# EAGLE design IOIO (EAGLE 5.11)
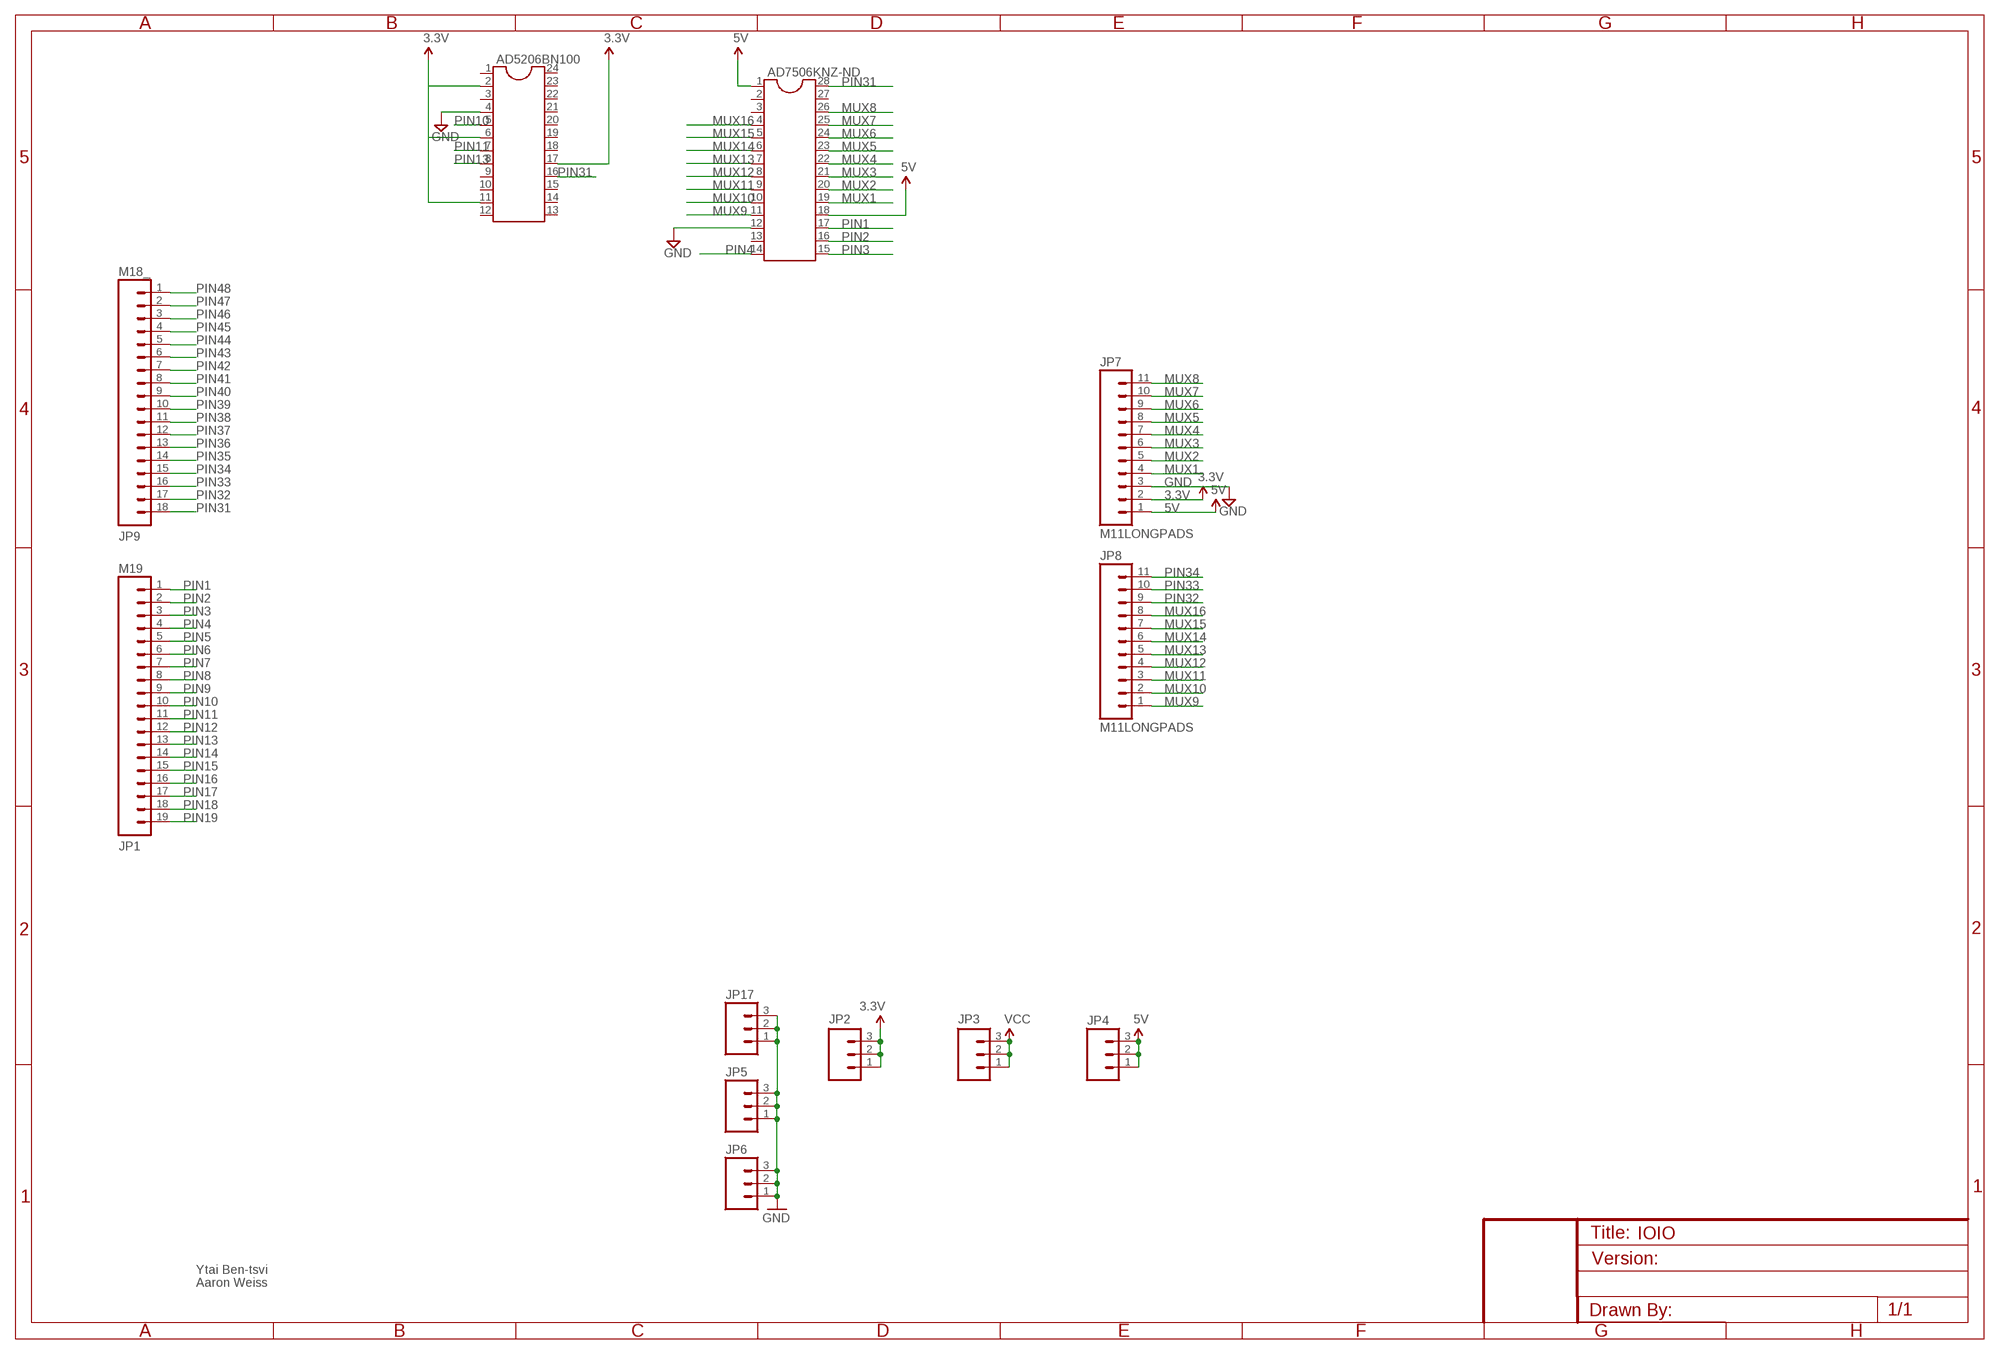
[diagram p0: schematic, sheet 1]

## Parts
AD5206BN100  DIL24-3  [DIL24-3]
AD7506KNZ-ND  DIL28  [DIL28-6]
JP1  M19  [1X19]
JP2  M03PTH  [1X03]
JP3  M03PTH  [1X03]
JP4  M03PTH  [1X03]
JP5  M03PTH  [1X03]
JP6  M03PTH  [1X03]
JP7  M11LONGPADS  [1X11_LONGPADS]
JP8  M11LONGPADS  [1X11_LONGPADS]
JP9  M18_  [1X18]
JP17  M03PTH  [1X03]

## Nets
3.3V: AD5206BN100.2 AD5206BN100.6 AD5206BN100.11 AD5206BN100.17 JP2.1 JP2.2 JP2.3 JP7.2
5V: AD7506KNZ-ND.1 AD7506KNZ-ND.18 JP4.1 JP4.2 JP4.3 JP7.1
GND: AD5206BN100.4 AD7506KNZ-ND.12 JP5.1 JP5.2 JP5.3 JP6.1 JP6.2 JP6.3 JP7.3 JP17.1 JP17.2 JP17.3
MUX1: AD7506KNZ-ND.19 JP7.4
MUX2: AD7506KNZ-ND.20 JP7.5
MUX3: AD7506KNZ-ND.21 JP7.6
MUX4: AD7506KNZ-ND.22 JP7.7
MUX5: AD7506KNZ-ND.23 JP7.8
MUX6: AD7506KNZ-ND.24 JP7.9
MUX7: AD7506KNZ-ND.25 JP7.10
MUX8: AD7506KNZ-ND.26 JP7.11
MUX9: AD7506KNZ-ND.11 JP8.1
MUX10: AD7506KNZ-ND.10 JP8.2
MUX11: AD7506KNZ-ND.9 JP8.3
MUX12: AD7506KNZ-ND.8 JP8.4
MUX13: AD7506KNZ-ND.7 JP8.5
MUX14: AD7506KNZ-ND.6 JP8.6
MUX15: AD7506KNZ-ND.5 JP8.7
MUX16: AD7506KNZ-ND.4 JP8.8
PIN1: AD7506KNZ-ND.17 JP1.1
PIN2: AD7506KNZ-ND.16 JP1.2
PIN3: AD7506KNZ-ND.15 JP1.3
PIN4: AD7506KNZ-ND.14 JP1.4
PIN5: JP1.5
PIN6: JP1.6
PIN7: JP1.7
PIN8: JP1.8
PIN9: JP1.9
PIN10: AD5206BN100.5 JP1.10
PIN11: AD5206BN100.7 JP1.11
PIN12: JP1.12
PIN13: AD5206BN100.8 JP1.13
PIN14: JP1.14
PIN15: JP1.15
PIN16: JP1.16
PIN17: JP1.17
PIN18: JP1.18
PIN19: JP1.19
PIN31: AD5206BN100.16 AD7506KNZ-ND.28 JP9.18
PIN32: JP8.9 JP9.17
PIN33: JP8.10 JP9.16
PIN34: JP8.11 JP9.15
PIN35: JP9.14
PIN36: JP9.13
PIN37: JP9.12
PIN38: JP9.11
PIN39: JP9.10
PIN40: JP9.9
PIN41: JP9.8
PIN42: JP9.7
PIN43: JP9.6
PIN44: JP9.5
PIN45: JP9.4
PIN46: JP9.3
PIN47: JP9.2
PIN48: JP9.1
VCC: JP3.1 JP3.2 JP3.3
Unconnected: AD5206BN100.1 AD5206BN100.3 AD5206BN100.9 AD5206BN100.10 AD5206BN100.12 AD5206BN100.13 AD5206BN100.14 AD5206BN100.15 AD5206BN100.18 AD5206BN100.19 AD5206BN100.20 AD5206BN100.21 AD5206BN100.22 AD5206BN100.23 AD5206BN100.24 AD7506KNZ-ND.2 AD7506KNZ-ND.3 AD7506KNZ-ND.13 AD7506KNZ-ND.27

## Notes on the sheet
- Ytai Ben-tsvi
- Aaron Weiss

## Library data of the parts
AD5206BN100 = ic-package:DIL24: Dual In Line
AD7506KNZ-ND = ic-package:DIL28: Dual In Line
JP1 = SparkFun:M19
JP2-JP6 JP17 = SparkFun:M03: Header 3 Standard 3-pin 0.1" header. Use with straight break away headers (SKU : PRT-00116), right angle break away headers (PRT-00553), swiss pins (PRT-00743), machine pins (PRT-00117), and female headers (PRT-00115). Molex polarized connector foot print use with SKU : PRT-08232 with associated crimp pins and housings.
JP7 JP8 = SparkFun:M11: Header 11 Standard 11-pin 0.1" header. Use with straight break away headers (SKU : PRT-00116), right angle break away headers (PRT-00553), swiss pins (PRT-00743), machine pins (PRT-00117), and female headers (PRT-00115).
JP9 = SparkFun:M18

## Board
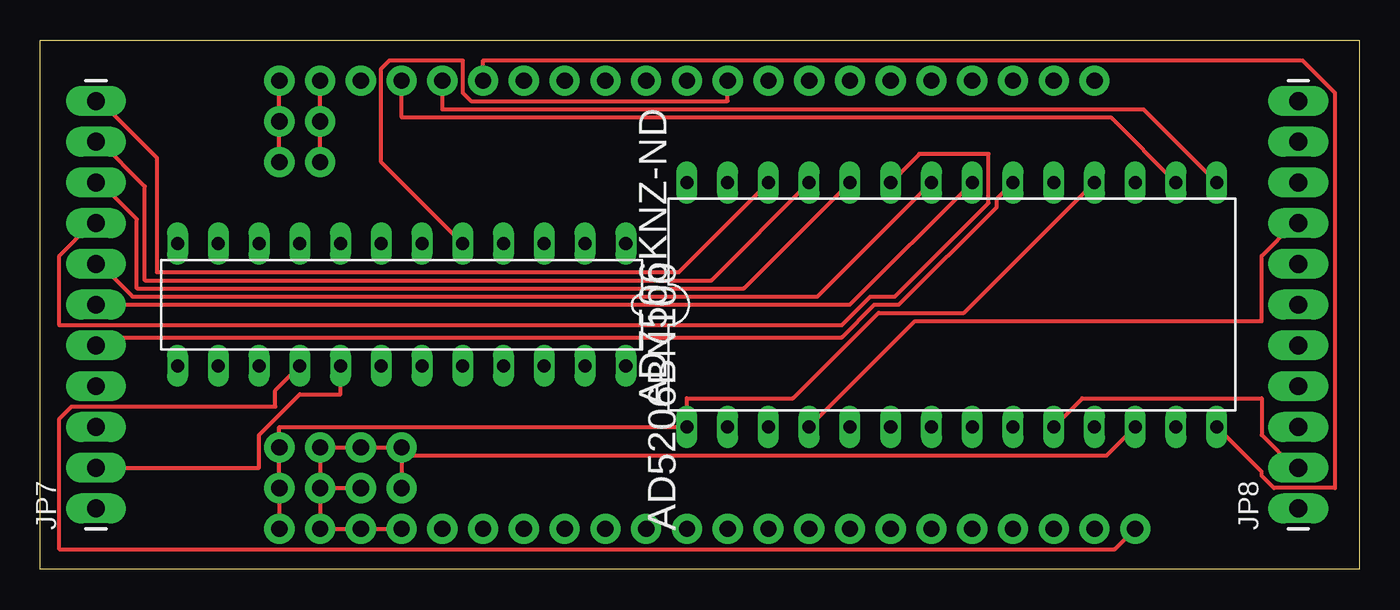
[diagram p1: board, top side]
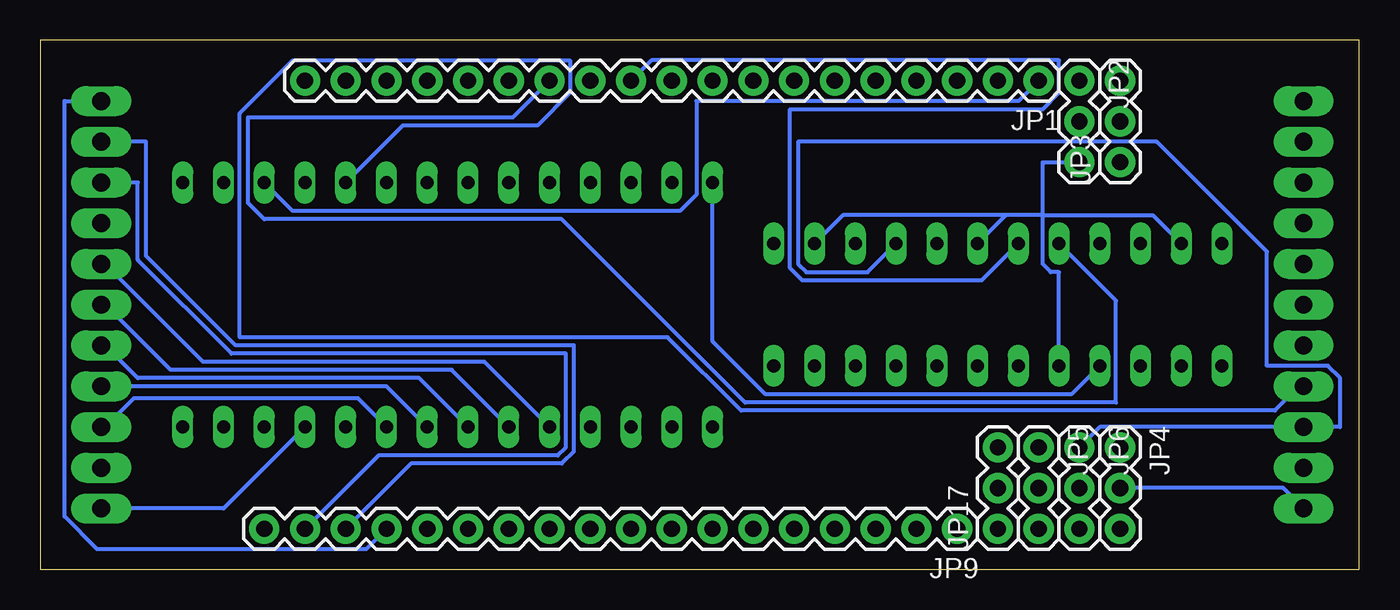
[diagram p2: board, bottom side, seen from below]

Size 82.22 x 33.01 mm. Coordinates in mm from the lower left corner, seen from the top.
Outline: 82.22,0 0,0 0,33.01 82.22,33.01 82.22,0
Copper layers (1*16): Top 0.035mm / dielectric 1.5mm / Bottom 0.035mm
Design rules "default": minimum track width 10mil, minimum drill 24mil, track to track 8mil, track to pad 8mil, pad to pad 8mil, via to via 8mil, smd to smd 8mil, copper to edge 40mil, drill to drill 8mil, minimum pad ring 10mil, minimum via ring 8mil, stop-mask expansion 4mil, vias tented up to drill 0mil, thermal gap 10mil

### Footprints (pad centres in the part's own frame; a part is rotated, then mirrored left to right if it is on the bottom)
DIL24-3 = drill 0.813 long: 1 -13.97,-3.81; 2 -11.43,-3.81; 3 -8.89,-3.81; 4 -6.35,-3.81; 5 -3.81,-3.81; 6 -1.27,-3.81; 7 1.27,-3.81; 8 3.81,-3.81; 9 6.35,-3.81; 10 8.89,-3.81; 11 11.43,-3.81; 12 13.97,-3.81; 13 13.97,3.81; 14 11.43,3.81; 15 8.89,3.81; 16 6.35,3.81; 17 3.81,3.81; 18 1.27,3.81; 19 -1.27,3.81; 20 -3.81,3.81; 21 -6.35,3.81; 22 -8.89,3.81; 23 -11.43,3.81; 24 -13.97,3.81
DIL28-6 = drill 0.813 long: 1 -16.51,-7.62; 2 -13.97,-7.62; 3 -11.43,-7.62; 4 -8.89,-7.62; 5 -6.35,-7.62; 6 -3.81,-7.62; 7 -1.27,-7.62; 8 1.27,-7.62; 9 3.81,-7.62; 10 6.35,-7.62; 11 8.89,-7.62; 12 11.43,-7.62; 13 13.97,-7.62; 14 16.51,-7.62; 15 16.51,7.62; 16 13.97,7.62; 17 11.43,7.62; 18 8.89,7.62; 19 6.35,7.62; 20 3.81,7.62; 21 1.27,7.62; 22 -1.27,7.62; 23 -3.81,7.62; 24 -6.35,7.62; 25 -8.89,7.62; 26 -11.43,7.62; 27 -13.97,7.62; 28 -16.51,7.62
1X19 = drill 1.016 pad 1.88 round: 1 0,0; 2 2.54,0; 3 5.08,0; 4 7.62,0; 5 10.16,0; 6 12.7,0; 7 15.24,0; 8 17.78,0; 9 20.32,0; 10 22.86,0; 11 25.4,0; 12 27.94,0; 13 30.48,0; 14 33.02,0; 15 35.56,0; 16 38.1,0; 17 40.64,0; 18 43.18,0; 19 45.72,0
1X03 = drill 1.016 pad 1.88 round: 1 0,0; 2 2.54,0; 3 5.08,0
1X11_LONGPADS = drill 1.118 pad 1.88 long: 1 0,0; 2 2.54,0; 3 5.08,0; 4 7.62,0; 5 10.16,0; 6 12.7,0; 7 15.24,0; 8 17.78,0; 9 20.32,0; 10 22.86,0; 11 25.4,0
1X18 = drill 1.016 pad 1.88 round: 1 0,0; 2 2.54,0; 3 5.08,0; 4 7.62,0; 5 10.16,0; 6 12.7,0; 7 15.24,0; 8 17.78,0; 9 20.32,0; 10 22.86,0; 11 25.4,0; 12 27.94,0; 13 30.48,0; 14 33.02,0; 15 35.56,0; 16 38.1,0; 17 40.64,0; 18 43.18,0

### Placement (x,y rotation side)
AD5206BN100  22.53,16.51 180 top
AD7506KNZ-ND  56.82,16.51 0 top
JP1  19.99,30.48 180 bottom
JP2  17.45,30.48 270 bottom
JP3  14.91,25.4 90 bottom
JP4  14.91,7.62 270 bottom
JP5  19.99,7.62 270 bottom
JP6  17.45,7.62 270 bottom
JP7  3.48,3.81 90 top
JP8  78.41,3.81 90 top
JP9  25.07,2.54 180 bottom
JP17  22.53,2.54 90 bottom

### Tracks (layer width: path | path; a pad name or v marks a point on that pad's centre or on a via)
3.3V
  Top 0.254: JP2.1 JP2.2 JP2.3 | JP7.2 13.64,6.35 13.64,8.38 16.18,10.92 18.72,10.92 AD5206BN100.17
  Bottom 0.254: AD5206BN100.17 18.72,18.54 19.23,18.54 19.74,19.05 19.74,22.1 | 19.74,22.1 19.74,25.4 JP2.3 | AD5206BN100.11 12.88,22.1 19.74,22.1 | 22.02,22.1 AD5206BN100.6 | 19.74,22.1 22.02,22.1 | AD5206BN100.2 32.18,22.1 22.02,22.1
5V
  Top 0.254: JP4.3 JP4.2 JP4.1 14.91,8.89 AD7506KNZ-ND.1 40.31,10.67 46.91,10.67 52.25,16 57.58,16 AD7506KNZ-ND.18
  Bottom 0.254: JP7.1 4.75,5.08 JP4.2
GND
  Top 0.254: JP6.2 JP6.3 JP5.3 JP17.1 | JP6.2 JP5.2 | JP6.2 JP6.1 JP5.1 JP17.3 22.53,7.11 | AD7506KNZ-ND.12 66.47,7.11 22.53,7.11 | 22.53,7.11 JP17.2
  Bottom 0.254: AD5206BN100.4 30.66,18.54 34.47,18.54 34.98,19.05 34.98,26.67 12.62,26.67 5.77,19.81 5.77,12.7 1.96,12.7 1.19,11.94 1.19,8.89 JP7.3 16.18,8.89 JP6.1
MUX1
  Bottom 0.254: AD7506KNZ-ND.19 59.61,27.69 51.23,27.69 49.2,29.72 49.2,31.75 66.47,31.75 69.77,28.45 69.77,14.48 43.1,14.48 38.53,9.91 5.26,9.91 3.73,11.43 JP7.4
MUX2
  Top 0.254: AD7506KNZ-ND.20 59.61,23.11 59.61,22.61 53.52,16.51 51.99,16.51 49.96,14.48 3.48,14.48 JP7.5
MUX3
  Top 0.254: AD7506KNZ-ND.21 50.47,16.51 JP7.6
MUX4
  Top 0.254: AD7506KNZ-ND.22 48.44,17.02 5.77,17.02 3.73,19.05 JP7.7
MUX5
  Top 0.254: AD7506KNZ-ND.23 54.79,25.91 59.11,25.91 59.11,22.86 53.26,17.02 51.74,17.02 49.96,15.24 1.19,15.24 1.19,19.56 3.23,21.59 JP7.8
MUX6
  Top 0.254: AD7506KNZ-ND.24 43.87,17.53 6.02,17.53 6.02,21.84 3.73,24.13 JP7.9
MUX7
  Top 0.254: AD7506KNZ-ND.25 41.83,18.03 6.53,18.03 6.53,23.88 3.73,26.67 JP7.10
MUX8
  Top 0.254: AD7506KNZ-ND.26 39.8,18.54 7.29,18.54 7.29,25.65 3.73,29.21 JP7.11
MUX9
  Bottom 0.254: AD7506KNZ-ND.11 70.79,3.81 JP8.1
MUX10
  Top 0.254: AD7506KNZ-ND.10 64.95,10.67 76.12,10.67 76.12,8.38 78.16,6.35 JP8.2
MUX11
  Bottom 0.254: AD7506KNZ-ND.9 62.41,10.67 76.38,10.67 78.16,8.89 JP8.3
MUX12
  Bottom 0.254: AD7506KNZ-ND.8 60.63,11.43 JP8.4
MUX13
  Bottom 0.254: AD7506KNZ-ND.7 58.6,11.94 76.12,11.94 78.16,13.97 JP8.5
MUX14
  Bottom 0.254: AD7506KNZ-ND.6 56.57,12.45 74.09,12.45 78.16,16.51 JP8.6
MUX15
  Bottom 0.254: AD7506KNZ-ND.5 54.53,12.95 72.06,12.95 78.16,19.05 JP8.7
MUX16
  Top 0.254: AD7506KNZ-ND.4 54.53,15.49 76.12,15.49 76.12,19.56 78.16,21.59 JP8.8
PIN1
  Bottom 0.254: AD7506KNZ-ND.17 66.47,22.35 42.34,22.35 41.33,23.37 41.33,29.21 21.26,29.21 JP1.1
PIN2
  Top 0.254: AD7506KNZ-ND.16 66.73,28.19 22.53,28.19 JP1.2
PIN3
  Top 0.254: AD7506KNZ-ND.15 68.76,28.7 25.07,28.7 JP1.3
PIN4
  Top 0.254: AD7506KNZ-ND.14 76.12,6.1 76.12,5.84 76.89,5.08 80.7,5.08 80.7,29.72 78.66,31.75 27.61,31.75 JP1.4
PIN10
  Top 0.254: AD5206BN100.5 21.26,25.4 21.26,31.24 21.77,31.75 26.34,31.75 26.34,29.72 26.85,29.21 42.85,29.21 JP1.10
PIN11
  Bottom 0.254: AD5206BN100.7 23.55,18.03 34.72,18.03 35.48,18.8 35.48,28.7 19.74,28.7 18.72,29.72 18.72,31.75 44.12,31.75 JP1.11
PIN13
  Bottom 0.254: AD5206BN100.8 15.16,16.76 15.16,10.41 38.28,10.41 49.71,21.84 68.25,21.84 69.27,22.86 69.27,28.19 52.76,28.19 JP1.13
PIN31
  Top 0.254: JP9.18 66.98,1.27 1.19,1.27 1.19,9.4 1.96,10.16 14.66,10.16 14.66,11.18 AD5206BN100.16
  Bottom 0.254: AD5206BN100.16 17.96,10.92 37.01,10.92 40.31,14.22 AD7506KNZ-ND.28
PIN32
  Bottom 0.254: JP9.17 61.14,7.11 49.96,7.11 49.45,7.62 49.45,13.46 70.28,13.46 76.12,19.3 76.12,24.13 JP8.9
PIN33
  Bottom 0.254: JP9.16 59.11,6.6 49.71,6.6 48.95,7.37 48.95,13.97 70.03,13.97 75.62,19.56 75.62,26.67 JP8.10
PIN34
  Bottom 0.254: JP9.15 61.9,1.27 78.66,1.27 80.7,3.3 80.7,29.21 JP8.11
VCC
  Top 0.254: JP3.1 JP3.2 JP3.3